# Altium schematic sheet RPI_CM3.SchDoc
size A3; DocumentNumber: 4; SheetNumber: 3; SheetTotal: 7; PostalCode_City: PostalCode_City; Country: Country; Company: Robert BOSCH GmbH; TelefonNumber: TelefonNumber; Street: Street; Department: Department
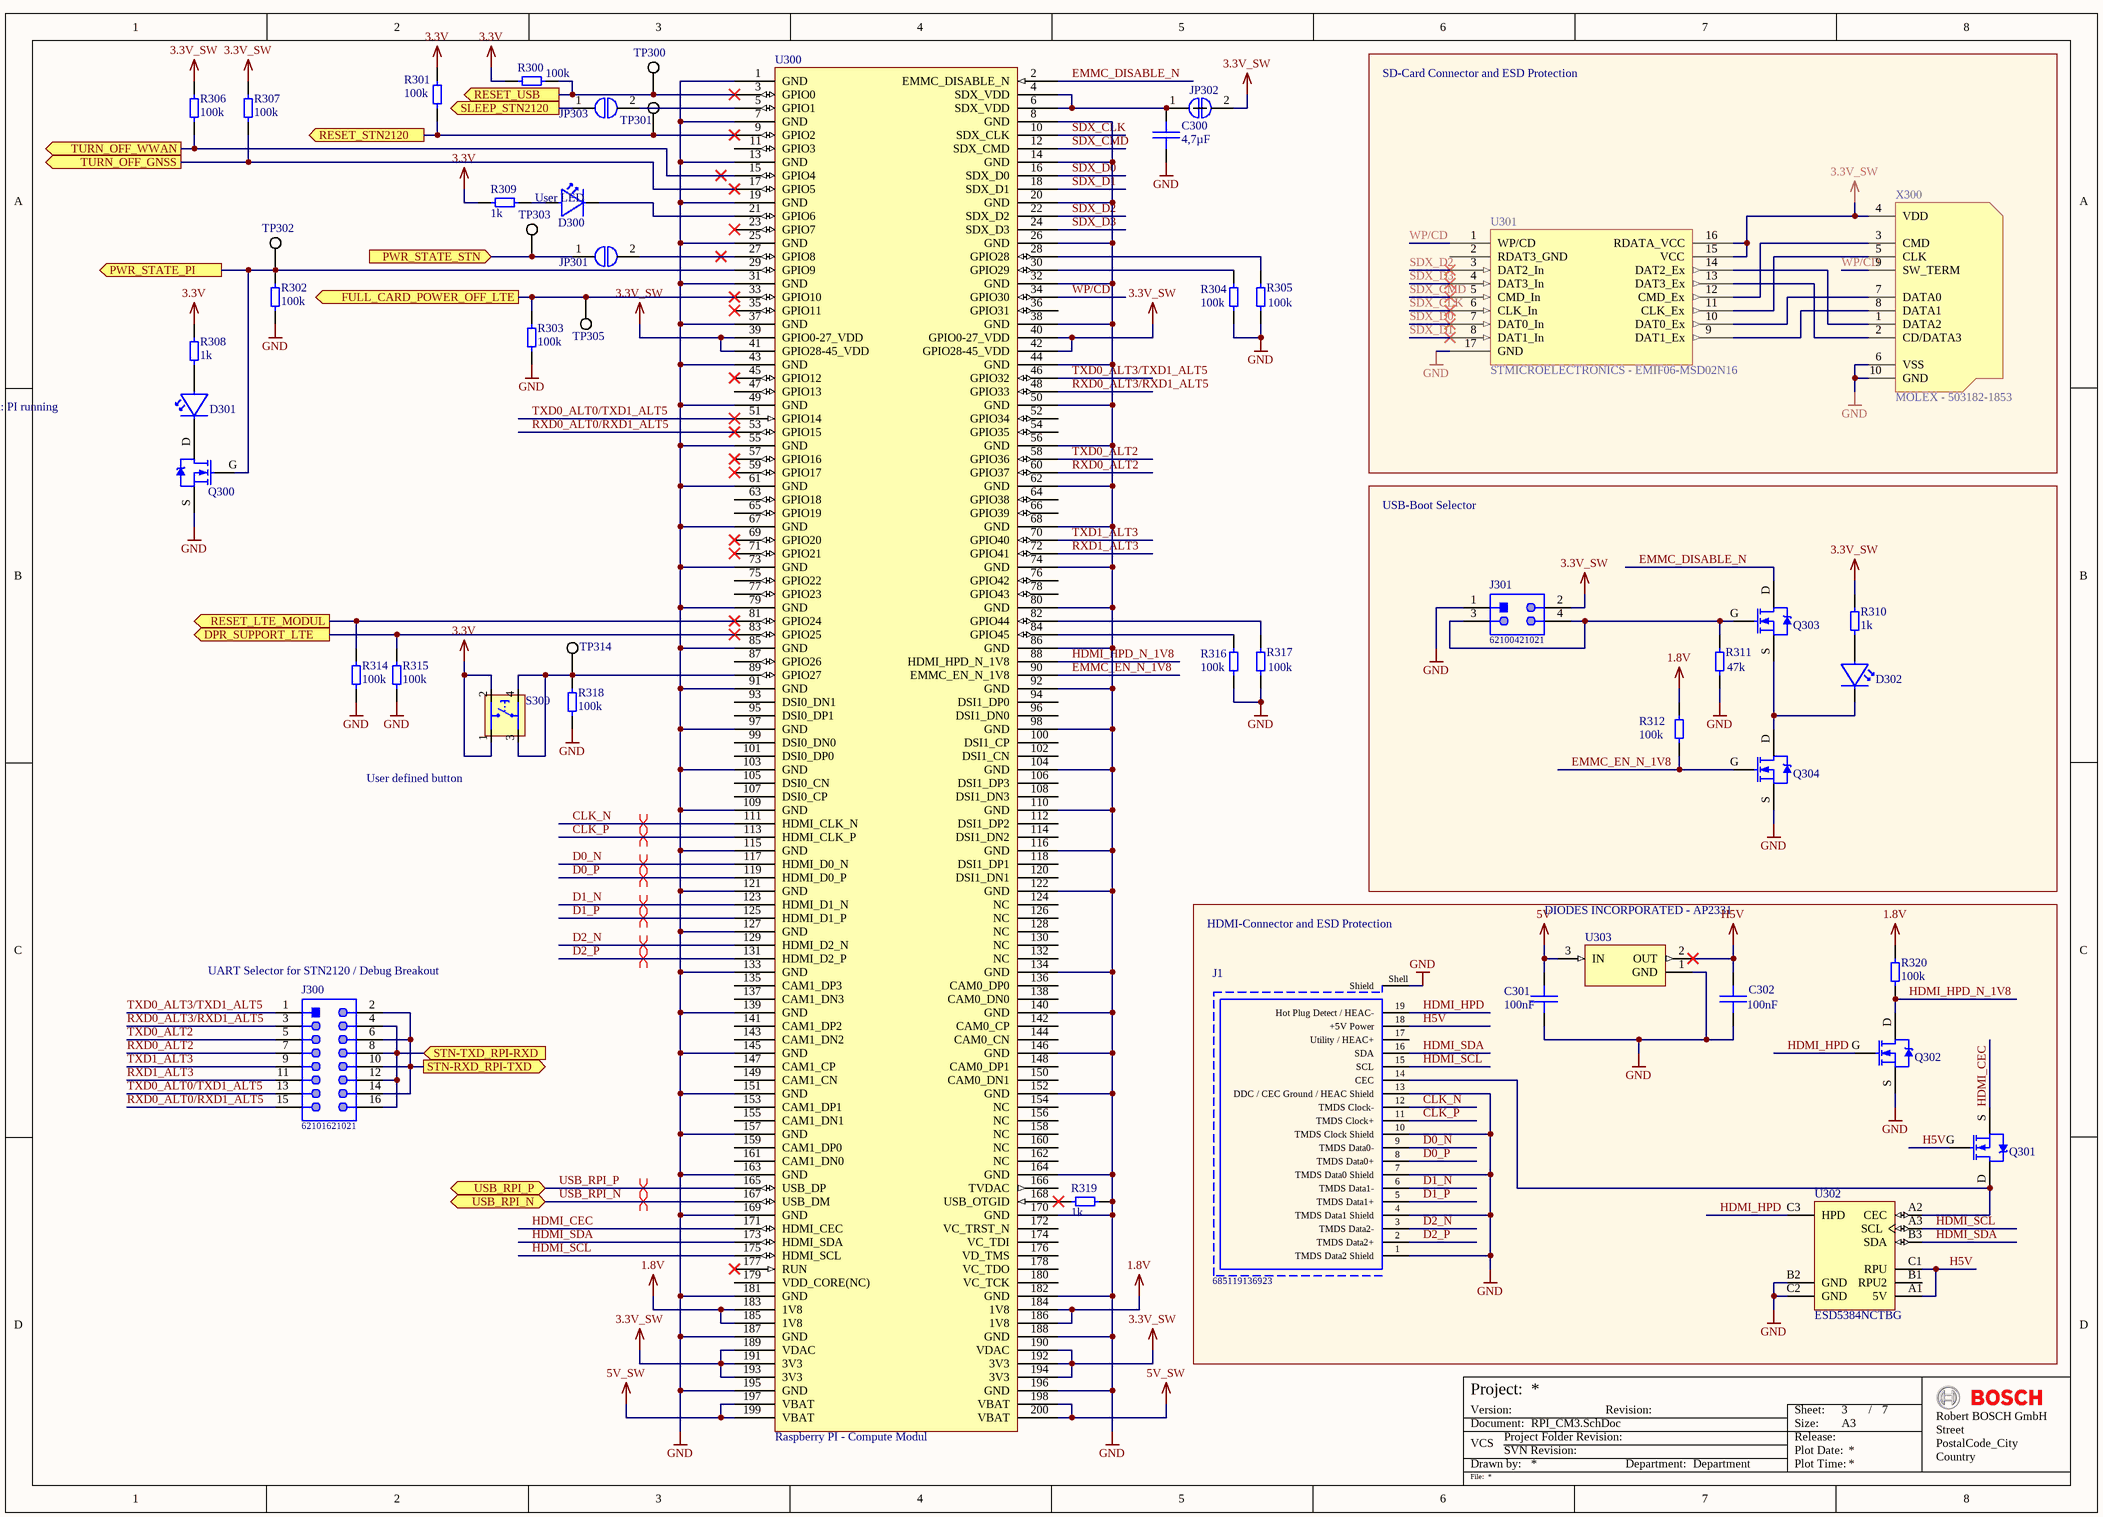
[diagram p0: RPI_CM3.SchDoc]

## Parts
C300  Capacitance: 4,7µF  [CAP 0603 [1608 Metric] X080 N]  (hidden comment: CAP 0603 4u7 -20% +20% 25V X5R)
C301  Capacitance: 100nF  [CAP 0402 [1005 Metric] X050 N]  (hidden comment: CAP 0402 100n -10% +10% 35V X5R)
C302  Capacitance: 100nF  [CAP 0402 [1005 Metric] X050 N]  (hidden comment: CAP 0402 100n -10% +10% 35V X5R)
D300  ROHM - SML-P11MT(R)  [ROHM - SML-P11x Series]  (value not drawn)
D301  ROHM - SML-P11MT(R)  [ROHM - SML-P11x Series]  (value not drawn)
D302  ROHM - SML-P11MT(R)  [ROHM - SML-P11x Series]  (value not drawn)
J1  685119136923  [685119136923]
J300  62101621021  [62101621021]
J301  62100421021  [62100421021]
JP301  Solder Jumper 0402 unbestückt  [Solder Jumper 0402 unbestückt]  (value not drawn)
JP302  Solder Jumper 0402 bestückt  [Solder Jumper 0402 bestückt]  (value not drawn)
JP303  Solder Jumper 0402 unbestückt  [Solder Jumper 0402 unbestückt]  (value not drawn)
Q300  ON SEMICONDUCTOR - BSS138  [SOT23127P600-8N]  (value not drawn)
Q301  ON SEMICONDUCTOR - BSS138  [SOT23127P600-8N]  (value not drawn)
Q302  ON SEMICONDUCTOR - BSS138  [SOT23127P600-8N]  (value not drawn)
Q303  ON SEMICONDUCTOR - BSS138  [SOT23127P600-8N]  (value not drawn)
Q304  ON SEMICONDUCTOR - BSS138  [SOT23127P600-8N]  (value not drawn)
R300  Resistance: 100k  [RES 0402 [1005 Metric]_N]  (hidden comment: RES 0402 100K 1% 62.5mW)
R301  Resistance: 100k  [RES 0402 [1005 Metric]_N]  (hidden comment: RES 0402 100K 1% 62.5mW)
R302  Resistance: 100k  [RES 0402 [1005 Metric]_N]  (hidden comment: RES 0402 100K 1% 62.5mW)
R303  Resistance: 100k  [RES 0402 [1005 Metric]_N]  (hidden comment: RES 0402 100K 1% 62.5mW)
R304  Resistance: 100k  [RES 0402 [1005 Metric]_N]  (hidden comment: RES 0402 100K 1% 62.5mW)
R305  Resistance: 100k  [RES 0402 [1005 Metric]_N]  (hidden comment: RES 0402 100K 1% 62.5mW)
R306  Resistance: 100k  [RES 0402 [1005 Metric]_N]  (hidden comment: RES 0402 100K 1% 62.5mW)
R307  Resistance: 100k  [RES 0402 [1005 Metric]_N]  (hidden comment: RES 0402 100K 1% 62.5mW)
R308  Resistance: 1k  [RES 0402 [1005 Metric]_N]  (hidden comment: RES 0402 1K 1% 62.5mW)
R309  Resistance: 1k  [RES 0402 [1005 Metric]_N]  (hidden comment: RES 0402 1K 1% 62.5mW)
R310  Resistance: 1k  [RES 0402 [1005 Metric]_N]  (hidden comment: RES 0402 1K 1% 62.5mW)
R311  Resistance: 47k  [RES 0402 [1005 Metric]_N]  (hidden comment: RES 0402 47K 1% 62.5mW)
R312  Resistance: 100k  [RES 0402 [1005 Metric]_N]  (hidden comment: RES 0402 100K 1% 62.5mW)
R314  Resistance: 100k  [RES 0402 [1005 Metric]_N]  (hidden comment: RES 0402 100K 1% 62.5mW)
R315  Resistance: 100k  [RES 0402 [1005 Metric]_N]  (hidden comment: RES 0402 100K 1% 62.5mW)
R316  Resistance: 100k  [RES 0402 [1005 Metric]_N]  (hidden comment: RES 0402 100K 1% 62.5mW)
R317  Resistance: 100k  [RES 0402 [1005 Metric]_N]  (hidden comment: RES 0402 100K 1% 62.5mW)
R318  Resistance: 100k  [RES 0402 [1005 Metric]_N]  (hidden comment: RES 0402 100K 1% 62.5mW)
R319  Resistance: 1k  [RES 0402 [1005 Metric]_N]  (hidden comment: RES 0402 1K 1% 62.5mW)
R320  Resistance: 100k  [RES 0402 [1005 Metric]_N]  (hidden comment: RES 0402 100K 1% 62.5mW)
S300  PANASONIC - EVQ-P7M01P  [EVQP7M]  (value not drawn)
TP300  Testpad, 1.0mm x 1.0mm, round  [Testpad, 1.0mm x 1.0mm, round]  (value not drawn)  (no BOM)
TP301  Testpad, 1.0mm x 1.0mm, round  [Testpad, 1.0mm x 1.0mm, round]  (value not drawn)  (no BOM)
TP302  Testpad, 1.0mm x 1.0mm, round  [Testpad, 1.0mm x 1.0mm, round]  (value not drawn)  (no BOM)
TP303  Testpad, 1.0mm x 1.0mm, round  [Testpad, 1.0mm x 1.0mm, round]  (value not drawn)  (no BOM)
TP305  Testpad, 1.0mm x 1.0mm, round  [Testpad, 1.0mm x 1.0mm, round]  (value not drawn)  (no BOM)
TP314  Testpad, 1.0mm x 1.0mm, round  [Testpad, 1.0mm x 1.0mm, round]  (value not drawn)  (no BOM)
U300  Raspberry PI - Compute Modul  [TE CONNECTIVITY -  1473005-4]
U301  STMICROELECTRONICS - EMIF06-MSD02N16  [QFN0P117X348X55_HS-17N]
U302  ESD5384NCTBG  [ONSC-WLCSP-9-567CX-01]
U303  DIODES INCORPORATED - AP2331  [DIODES INCORPORATED - SOT23]
X300  MOLEX - 503182-1853  [MOLEX - 503182-1853]

## Blocks framed on the sheet
SD-Card Connector and ESD Protection: U301 X300
USB-Boot Selector: D302 J301 Q303 Q304 R310-R312
HDMI-Connector and ESD Protection: C301 C302 J1 Q301 Q302 R320 U302 U303

## Ports
DPR_SUPPORT_LTE (out), FULL_CARD_POWER_OFF_LTE (out), PWR_STATE_PI (out), PWR_STATE_STN (in), RESET_LTE_MODUL (out), RESET_STN2120 (out), RESET_USB (out), SLEEP_STN2120 (out), STN-RXD_RPI-TXD (out), STN-TXD_RPI-RXD (in), TURN_OFF_GNSS (out), TURN_OFF_WWAN (out), USB_RPI_N (bidir), USB_RPI_P (bidir)

## Nets
1.8V: R312.2 R320.2 U300.183(1V8) U300.184(1V8) U300.185(1V8) U300.186(1V8)
3.3V: R300.2 R301.2 R308.1 R309.1 S300.1 S300.2
3.3V_SW: J301.2 JP302.2 R306.1 R307.1 R310.2 U300.39(GPIO0-27_VDD) U300.40(GPIO0-27_VDD) U300.41(GPIO28-45_VDD) U300.42(GPIO28-45_VDD) U300.189(VDAC) U300.190(VDAC) U300.191(3V3) U300.192(3V3) U300.193(3V3) U300.194(3V3) U301.15(VCC) U301.16(RDATA_VCC) X300.4(VDD)
5V: C301.2 U303.3(IN)
5V_SW: U300.197(VBAT) U300.198(VBAT) U300.199(VBAT) U300.200(VBAT)
GND: C300.1 C301.1 C302.1 J1.1(TMDS_Data2_Shield) J1.4(TMDS_Data1_Shield) J1.7(TMDS_Data0_Shield) J1.10(TMDS_Clock_Shield) J1.13(DDC_/_CEC_Ground_/_HEAC_Shield) J1.Shell(Shield) J301.1 Q300.S Q302.S Q304.S R302.1 R303.1 R304.1 R305.1 R311.1 R314.1 R315.1 R316.1 R317.1 R318.1 R319.2 U300.1(GND) U300.7(GND) U300.8(GND) U300.13(GND) U300.14(GND) U300.19(GND) U300.20(GND) U300.25(GND) U300.26(GND) U300.31(GND) U300.32(GND) U300.37(GND) U300.38(GND) U300.43(GND) U300.44(GND) U300.49(GND) U300.50(GND) U300.55(GND) U300.56(GND) U300.61(GND) U300.62(GND) U300.67(GND) U300.68(GND) U300.73(GND) U300.74(GND) U300.79(GND) U300.80(GND) U300.85(GND) U300.86(GND) U300.91(GND) U300.92(GND) U300.97(GND) U300.98(GND) U300.103(GND) U300.104(GND) U300.109(GND) U300.110(GND) U300.115(GND) U300.116(GND) U300.121(GND) U300.122(GND) U300.127(GND) U300.133(GND) U300.134(GND) U300.139(GND) U300.140(GND) U300.145(GND) U300.146(GND) U300.151(GND) U300.152(GND) U300.157(GND) U300.163(GND) U300.164(GND) U300.169(GND) U300.170(GND) U300.181(GND) U300.182(GND) U300.187(GND) U300.188(GND) U300.195(GND) U300.196(GND) U301.17(GND) U302.B2(GND) U302.C2(GND) U303.1(GND) X300.6(VSS) X300.10(GND)
H5V: C302.2 J1.18(+5V_Power) Q301.G U302.A1(5V) U302.C1(RPU) U303.2(OUT)
CLK_N: J1.12(TMDS_Clock-) U300.111(HDMI_CLK_N)
CLK_P: J1.11(TMDS_Clock+) U300.113(HDMI_CLK_P)
D0_N: J1.9(TMDS_Data0-) U300.117(HDMI_D0_N)
D0_P: J1.8(TMDS_Data0+) U300.119(HDMI_D0_P)
D1_N: J1.6(TMDS_Data1-) U300.123(HDMI_D1_N)
D1_P: J1.5(TMDS_Data1+) U300.125(HDMI_D1_P)
D2_N: J1.3(TMDS_Data2-) U300.129(HDMI_D2_N)
D2_P: J1.2(TMDS_Data2+) U300.131(HDMI_D2_P)
DPR_SUPPORT_LTE: R315.2 U300.83(GPIO25) ; port DPR_SUPPORT_LTE
EMMC_DISABLE_N: Q303.D U300.2(EMMC_DISABLE_N)
EMMC_EN_N_1V8: Q304.G R312.1 U300.90(EMMC_EN_N_1V8)
FULL_CARD_POWER_OFF_LTE: R303.2 TP305.1 U300.33(GPIO10) ; port FULL_CARD_POWER_OFF_LTE
HDMI_CEC: Q301.S U300.171(HDMI_CEC)
HDMI_HPD: J1.19(Hot_Plug_Detect_/_HEAC-) Q302.G U302.C3(HPD)
HDMI_HPD_N_1V8: Q302.D R320.1 U300.88(HDMI_HPD_N_1V8)
HDMI_SCL: J1.15(SCL) U300.175(HDMI_SCL) U302.A3(SCL)
HDMI_SDA: J1.16(SDA) U300.173(HDMI_SDA) U302.B3(SDA)
PWR_STATE_PI: Q300.G R302.2 TP302.1 U300.29(GPIO9) ; port PWR_STATE_PI
PWR_STATE_STN: JP301.1 TP303.1 ; port PWR_STATE_STN
RESET_LTE_MODUL: R314.2 U300.81(GPIO24) ; port RESET_LTE_MODUL
RESET_STN2120: R301.1 TP301.1 U300.9(GPIO2) ; port RESET_STN2120
RESET_USB: R300.1 TP300.1 U300.3(GPIO0) ; port RESET_USB
RXD0_ALT0/RXD1_ALT5: J300.15 U300.53(GPIO15)
RXD0_ALT2: J300.7 U300.60(GPIO37)
RXD0_ALT3/RXD1_ALT5: J300.3 U300.48(GPIO33)
RXD1_ALT3: J300.11 U300.72(GPIO41)
SDX_CLK: U300.10(SDX_CLK) U301.6(CLK_In)
SDX_CMD: U300.12(SDX_CMD) U301.5(CMD_In)
SDX_D0: U300.16(SDX_D0) U301.7(DAT0_In)
SDX_D1: U300.18(SDX_D1) U301.8(DAT1_In)
SDX_D2: U300.22(SDX_D2) U301.3(DAT2_In)
SDX_D3: U300.24(SDX_D3) U301.4(DAT3_In)
SLEEP_STN2120: JP303.1 ; port SLEEP_STN2120
STN-RXD_RPI-TXD: J300.2 J300.6 J300.10 J300.14 ; port STN-RXD_RPI-TXD
STN-TXD_RPI-RXD: J300.4 J300.8 J300.12 J300.16 ; port STN-TXD_RPI-RXD
TURN_OFF_GNSS: R307.2 U300.17(GPIO5) ; port TURN_OFF_GNSS
TURN_OFF_WWAN: R306.2 U300.15(GPIO4) ; port TURN_OFF_WWAN
TXD0_ALT0/TXD1_ALT5: J300.13 U300.51(GPIO14)
TXD0_ALT2: J300.5 U300.58(GPIO36)
TXD0_ALT3/TXD1_ALT5: J300.1 U300.46(GPIO32)
TXD1_ALT3: J300.9 U300.70(GPIO40)
USB_RPI_N: U300.167(USB_DM) ; port USB_RPI_N
USB_RPI_P: U300.165(USB_DP) ; port USB_RPI_P
WP/CD: U300.34(GPIO30) U301.1(WP/CD) X300.9(SW_TERM)
NetC300_2: C300.2 JP302.1 U300.4(SDX_VDD) U300.6(SDX_VDD)
NetD300_A: D300.A R309.2
NetD300_C: D300.C U300.21(GPIO6)
NetD301_A: D301.A R308.2
NetD301_C: D301.C Q300.D
NetD302_A: D302.A R310.1
NetD302_C: D302.C Q303.S Q304.D
NetJ1_14: J1.14(CEC) Q301.D U302.A2(CEC)
NetJ301_3: J301.3 J301.4 Q303.G R311.2
NetJP301_2: JP301.2 U300.27(GPIO8)
NetJP303_2: JP303.2 U300.5(GPIO1)
NetR304_2: R304.2 U300.30(GPIO29)
NetR305_2: R305.2 U300.28(GPIO28)
NetR316_2: R316.2 U300.84(GPIO45)
NetR317_2: R317.2 U300.82(GPIO44)
NetR318_2: R318.2 S300.3 S300.4 TP314.1 U300.89(GPIO27)
NetR319_1: R319.1 U300.168(USB_OTGID)
NetU301_9: U301.9(DAT1_Ex) X300.8(DATA1)
NetU301_10: U301.10(DAT0_Ex) X300.7(DATA0)
NetU301_11: U301.11(CLK_Ex) X300.5(CLK)
NetU301_12: U301.12(CMD_Ex) X300.3(CMD)
NetU301_13: U301.13(DAT3_Ex) X300.2(CD/DATA3)
NetU301_14: U301.14(DAT2_Ex) X300.1(DATA2)

Not connected (* = marked no-connect by the designer): J1 17(Utility_/_HEAC+); U300 11(GPIO3) 23(GPIO7)* 35(GPIO11)* 36(GPIO31) 45(GPIO12)* 47(GPIO13) 52(GPIO34) 54(GPIO35) 57(GPIO16)* 59(GPIO17)* 63(GPIO18) 64(GPIO38) 65(GPIO19) 66(GPIO39) 69(GPIO20)* 71(GPIO21)* 75(GPIO22) 76(GPIO42) 77(GPIO23) 78(GPIO43) 87(GPIO26) 93(DSI0_DN1) 94(DSI1_DP0) 95(DSI0_DP1) 96(DSI1_DN0) 99(DSI0_DN0) 100(DSI1_CP) 101(DSI0_DP0) 102(DSI1_CN) 105(DSI0_CN) 106(DSI1_DP3) 107(DSI0_CP) 108(DSI1_DN3) 112(DSI1_DP2) 114(DSI1_DN2) 118(DSI1_DP1) 120(DSI1_DN1) 124(NC) 126(NC) 128(NC) 130(NC) 132(NC) 135(CAM1_DP3) 136(CAM0_DP0) 137(CAM1_DN3) 138(CAM0_DN0) 141(CAM1_DP2) 142(CAM0_CP) 143(CAM1_DN2) 144(CAM0_CN) 147(CAM1_CP) 148(CAM0_DP1) 149(CAM1_CN) 150(CAM0_DN1) 153(CAM1_DP1) 154(NC) 155(CAM1_DN1) 156(NC) 158(NC) 159(CAM1_DP0) 160(NC) 161(CAM1_DN0) 162(NC) 166(TVDAC) 172(VC_TRST_N) 174(VC_TDI) 176(VD_TMS) 177(RUN)* 178(VC_TDO) 179(VDD_CORE(NC)) 180(VC_TCK); U301 2(RDAT3_GND); U302 B1(RPU2)

## Layout directives
differential pair; differential pair class DIFF100: CLK_N, CLK_P, D0_N, D0_P, D1_N, D1_P, D2_N, D2_P
differential pair; differential pair class DIFF90: USB_RPI_N, USB_RPI_P

## Notes on the sheet
- (near D300) User LED
- LED On: PI running
- User defined button
- (near J300) UART Selector for STN2120 / Debug Breakout
- Project:
- Document:
- Drawn by:
- VCS
- Version:
- Project Folder Revision:
- SVN Revision:
- Revision:
- Department:
- Plot Date:
- Size:
- Sheet:
- Plot Time:
- Release:
- A3
- /
- File:

## Library data of the parts
C300 = CMP-05102-1: SMD/SMT 0603 25V -20% +20% X5R - Multilayer Ceramic Capacitors MLCC; Manufacturer: TDK; Manufacturer Part Number: C1608X5R1E475M080AC; Assembly: yes; Capacitance Tolerance pos: 20%; Value: 4,7µF; ItemHRID: CMP-03365; RevisionId: 2; AccessRights: 15; Folder: 10 Library\Component Library\Passive Components\Capacitors\Ceramic Capacitors\; ContentType: Component; Capacitance Tolerance neg: -20%; Case: 0603 [1608]; ComponentLink1Description: Datasheet; ComponentLink1URL: http://www.farnell.com/datasheets/2291921.pdf; Dielectric Type: X5R; IPC Footprint Naming: CAPC1608X080; Mounting Type: SMT; Operating Temperature max: 85°C; Operating Temperature min: -55°C; Voltage Rating: 25V; ReleaseDate: 20/01/2017 12:59:13 PM; ComponentType: Ceramic Capacitor; FolderGUID: 1B932E09-F2A4-48AF-86E9-372599342254; LifeCycle: In Design; AncestorItemRevisionGUID: E51D455D-F8A1-44A6-8671-03D7555E002A; LifeCycleStateGUID: E3052186-9469-4B71-ADAB-0D319103D948; ContentTypeGUID: CB3C11C4-E317-11DF-B822-12313F0024A2; ItemGUID: 2606C917-888A-4062-919A-A6B1386C23AD
C301 C302 = CMP-06091-1: SMD/SMT 0402 35V -10% +10% X5R - Multilayer Ceramic Capacitors MLCC; Manufacturer: TDK; Manufacturer Part Number: C1005X5R1V104K050BB; Assembly: yes; Value: 100nF; Capacitance Tolerance pos: 10%; Case: 0402 [1005]; ComponentLink1Description: Datasheet; ComponentLink1URL: https://de.farnell.com/tdk/c1005x5r1v104k050bb/kondensator-0-1-f-35v-10-x5r-0402/dp/2528760?st=100n%200402%2035v; Dielectric Type: X5R; IPC Footprint Naming: CAPC1005X050; Mounting Type: SMT; Operating Temperature max: 85°C; Operating Temperature min: -55°C; Voltage Rating: 35V; Capacitance Tolerance neg: -10%
D300-D302 = CMP-06096-1: Standard LEDs - SMD Yellowish Green 569nm 2.1mcd 50mW Pd 1.9V Vf; Assembly: yes; Forward Current LED1: 20mA; Forward Voltage LED1: 1,9V; Reverse Voltage LED1: 5V; Case: 0402; Colour LED1: yellowish green; ComponentLink1Description: Datahseet; ComponentLink1URL: https://d1d2qsbl8m0m72.cloudfront.net/en/products/databook/datasheet/opto/led/chip_mono/sml-p11-e.pdf; Luminous Intensity LED1: 2.1mcd; Manufacturer: ROHM; Manufacturer Part Number: SML-P11MT(R); Mounting Type: SMT; Operating Temperature max: 85°C; Operating Temperature min: -40°C; Wavelength LED1: 569nm
J1 = CMP-1502-00171-1: Mini HDMI Type C Receptacle WR-COM, Horizontal, SMT; Manufacturer: Wurth Elektronik; Rated Current: 0.5A; Contact Resistance: 30mOhm; Working Voltage: 40VAC; Orientation: Horizontal; Publisher: WurthElektronik; Package Reference: 685119136923; Mounting Technology: SMT; Packaging: TapeandReel; Manufacturer URL: http://www.we-online.de; Part Number: 685119136923; Datasheet URL: https://katalog.we-online.de/em/datasheet/685119136923.pdf; Connector Type: MiniHDMITypeC; Gender: Receptacle; Operating Temperature: -25to85degC
J300 = CMP-1502-00929-1: SMT Vertical Pin Header WR-PHD, Pitch 1.27 mm, Dual Row, 16 pins; Manufacturer: Wurth Elektronik; Rated Current: 1A; Gender: Male; Withstanding Voltage: 500VAC; Pitch: 1.27mm; Contact Resistance: 20mOhm; Pin Number: 16; Working Voltage: 100VAC; Operating Temperature: -40to105degC; Publisher: WurthElektronik; Manufacturer URL: http://www.we-online.de; Part Number: 62101621021; Mounting Technology: SMT; Orientation: Vertical; Row Number: Dual; Package Reference: 62101621021; Datasheet URL: https://katalog.we-online.de/em/datasheet/62101621021.pdf; Packaging: Tube
J301 = CMP-1502-00925-1: SMT Vertical Pin Header WR-PHD, Pitch 1.27 mm, Dual Row, 4 pins; Manufacturer: Wurth Elektronik; Rated Current: 1A; Contact Resistance: 20mOhm; Withstanding Voltage: 500VAC; Gender: Male; Pitch: 1.27mm; Working Voltage: 100VAC; Pin Number: 4; Mounting Technology: SMT; Package Reference: 62100421021; Part Number: 62100421021; Packaging: Tube; Operating Temperature: -40to105degC; Manufacturer URL: http://www.we-online.de; Orientation: Vertical; Row Number: Dual; Datasheet URL: https://katalog.we-online.de/em/datasheet/62100421021.pdf; Publisher: WurthElektronik
JP301 JP303 = CMP-04662-5: Assembly: no; Case: -; ComponentLink1Description: Datasheet; Manufacturer: -; Manufacturer Part Number: -; Mounting Type: -; Operating Temperature max: 0°C; Operating Temperature min: 0°C
JP302 = CMP-04663-3: Manufacturer: YAGEO; Manufacturer Part Number: RC0402JR-070RL; Assembly: yes; Case: 0402; ComponentLink1Description: Datasheet; ComponentLink1URL: http://docs-europe.electrocomponents.com/webdocs/13ec/0900766b813ecb03.pdf; Mounting Type: SMT; Operating Temperature max: 155°C; Operating Temperature min: -55°C
Q300-Q304 = CMP-00444-5: MOSFET N-CH 50V 220MA SOT-23; Threshold Voltage: 1.3V; Transistor Polarity: N-Channel; Assembly: yes; Drain Source On Resistance: 3.5; Gate Source Voltage: 20V; Operating Temperature min: -55°C; Case: SOT23-3; ComponentLink1Description: Datasheet; ComponentLink1URL: https://www.onsemi.com/pub/Collateral/BSS138-D.PDF; Drain Current DC: 220mA; Drain Source Voltage: 50V; Manufacturer: ON SEMICONDUCTOR; Manufacturer Part Number: BSS138; Mounting Type: SMT; Operating Temperature max: 150°C
R300-R307 R312 R314-R318 R320 = CMP-01074-3: RC0402 series chip resistor with lead-free terminations made by thick film process; Manufacturer: YAGEO; Manufacturer Part Number: RC0402FR-07100KL; Assembly: yes; Current Rating: 1A; Power Rating: 62,5mW; Temperature Coefficient: ±100ppm/K; Voltage Rating: 50V; Case: 0402 [1005]; ComponentLink1Description: Datasheet; ComponentLink1URL: http://www.yageo.com/documents/recent/PYu-RC0402_51_RoHS_L_6.pdf; IPC Footprint Naming: RESC1005X04; Mounting Type: SMT; Operating Temperature max: 155°C; Operating Temperature min: -55°C; Resistance Tolerance: 1%; Resistor Element Type: Thick Film; Value: 100k
R308-R310 R319 = CMP-00843-3: RC0402 series chip resistor with lead-free terminations made by thick film process; Manufacturer Part Number: RC0402FR-071KL; Manufacturer: YAGEO; Power Rating: 62,5mW; Temperature Coefficient: ±100ppm/K; Voltage Rating: 50V; Assembly: yes; Current Rating: 1A; Mounting Type: SMT; Operating Temperature max: 155°C; Operating Temperature min: -55°C; Resistance Tolerance: 1%; Resistor Element Type: Thick Film; Value: 1k; Case: 0402 [1005]; ComponentLink1Description: Datasheet; ComponentLink1URL: http://www.yageo.com/documents/recent/PYu-RC0402_51_RoHS_L_6.pdf; IPC Footprint Naming: RESC1005X04
R311 = CMP-01036-3: RC0402 series chip resistor with lead-free terminations made by thick film process; Manufacturer: YAGEO; Manufacturer Part Number: RC0402FR-0747KL; Assembly: yes; Current Rating: 1A; Temperature Coefficient: ±100ppm/K; Voltage Rating: 50V; Case: 0402 [1005]; ComponentLink1Description: Datasheet; ComponentLink1URL: http://www.yageo.com/documents/recent/PYu-RC0402_51_RoHS_L_6.pdf; IPC Footprint Naming: RESC1005X04; Mounting Type: SMT; Operating Temperature max: 155°C; Operating Temperature min: -55°C; Power Rating: 62.5mW; Resistance Tolerance: 1%; Resistor Element Type: Thick Film; Value: 47k
S300 = CMP-00429-5: Tactile Switch SPST-NO Side Actuated Surface Mount, Right Angle; Assembly: yes; Contact Current Rating: 50mA; Contact Voltage DC: 12V; Number of Position: 1; Switch Function: off - on; Operating Temperature max: 70°C; Operating Temperature min: -20°C; Switch Type: Tactile; Case: EVQP7M; ComponentLink1Description: Datasheet; ComponentLink1URL: https://industrial.panasonic.com/cdbs/www-data/pdf/ATK0000/ATK0000CE20.pdf; Contact Form: SPST-NO; Manufacturer: PANASONIC; Mounting Type: SMT; Manufacturer Part Number: EVQ-P7M01P
TP300-TP303 TP305 TP314 = CMP-04511-8: Assembly: no; Case: 1.0x1.0mm, round
U300 = CMP-06101-2: Compute Module SODIMM Pinout for CM3 Lite, also compatible with CM1 and CM3 check Datasheet.; Manufacturer: TE CONNECTIVITY; Manufacturer Part Number: 1473005-4; Assembly: yes; Number of Position: 200; Pitch Spacing: 600µm; Core Architecture: ARM; Case: DDR2-SODIMM; ComponentLink1Description: Datasheet; ComponentLink1URL: https://www.te.com/commerce/DocumentDelivery/DDEController?Action=showdoc&DocId=Customer+Drawing%7F1473005%7FJ3%7Fpdf%7FEnglish%7FENG_CD_1473005_J3.pdf%7F1473005-4; Mounting Type: SMT; Number of Rows: 2; Operating Temperature max: 85°C; Operating Temperature min: -55°C; Socket for Case Type: SODIMM; Case/Package: Module; Evaluation Kit: Yes
U301 = CMP-06814-1: 6-line IPAD¿, EMI filter and ESD protection; Assembly: yes; Breakdown Voltage: 5V; ESD Voltage Air: 12kV; ESD Voltage Contact: 8kV; No. of Channels: 6; Case: Micro QFN 3.5x1.2 16L; ComponentLink1Description: Datasheet; ComponentLink1URL: https://www.st.com/resource/en/datasheet/emif06-msd02n16.pdf; IPC Footprint Naming: QFN40P117X348X55-17; Manufacturer: STMicroelectronics; Manufacturer Part Number: EMIF06-MSD02N16; Mounting Type: SMT; Operating Temperature max: 85°C; Operating Temperature min: -30°C
U302 = CMP-1063-00280-1: 5-Line HDMI Control Line, ESD Protection, 9-Pin WLCSP, Pb-Free, Tape and Reel; Manufacturer: On Semiconductor; Direction: Unidirectional; V(BR) Min (V): 6; Number of Lines: 5; ComponentLink1URL: http://www.onsemi.com/; DatasheetVersion: Rev. 0; ComponentLink2URL: http://www.onsemi.cn/pub_link/Collateral/ESD5384-D.PDF; PackageDescription: 9-Ball Wafer Level Chip Scale Package, Body 1.14 x 1.14 mm, Pitch 0.4 mm; Packing: Tape and Reel; ComponentLink3URL: http://www.onsemi.cn/pub_link/Collateral/567CX.PDF; PackageVersion: Rev. O, 10/2010; PackageReference: WLCSP-9-567CX-01; ComponentLink3Description: Package Specification; RoHS: Pb-Free; PartNumber: ESD5384NCTBG; ComponentLink1Description: Manufacturer URL; Mounting Technology: Surface Mount; ComponentLink2Description: Datasheet
U303 = CMP-06926-2: 0.2A Single Channel Current-Limited Load Switch; Manufacturer Part Number: AP2331SA-7; Assembly: yes; Input Voltage max: 6,5V; Input Voltage min: 2,7V; No. of Outputs: 1; Output Current max: 200mA; Case: SOT23; ComponentLink1URL: https://www.diodes.com/assets/Datasheets/AP2331.pdf; Manufacturer: DIODES INCORPORATED; Mounting Type: SMT; Operating Temperature max: 85°C; Operating Temperature min: -40°C
X300 = CMP-00377-6: 1.09mm Pitch, microSD Memory Card Connector, Ultra Low-Profile, Push-Push Type, 1.45mm Height, Anti-card fly-out; Current Rating: 500mA; Memory Type: microSD Card; Assembly: yes; Case: microSD Card Connector; ComponentLink1Description: Datasheet; ComponentLink1URL: http://www.deutsch.molex.com/molex/products/datasheet.jsp?part=active/5031821853_MEMORY_CARD_SOCKET.xml; Contact Plating: gold; Manufacturer: MOLEX; Manufacturer Part Number: 503182-1853; Mounting Type: SMT; Number of Rows: 1; Operating Temperature max: 85°C; Operating Temperature min: -25°C; Pitch Spacing: 1.09mm; Number of Pins: 8